# Altium schematic sheet Electromagnet.SchDoc
size A
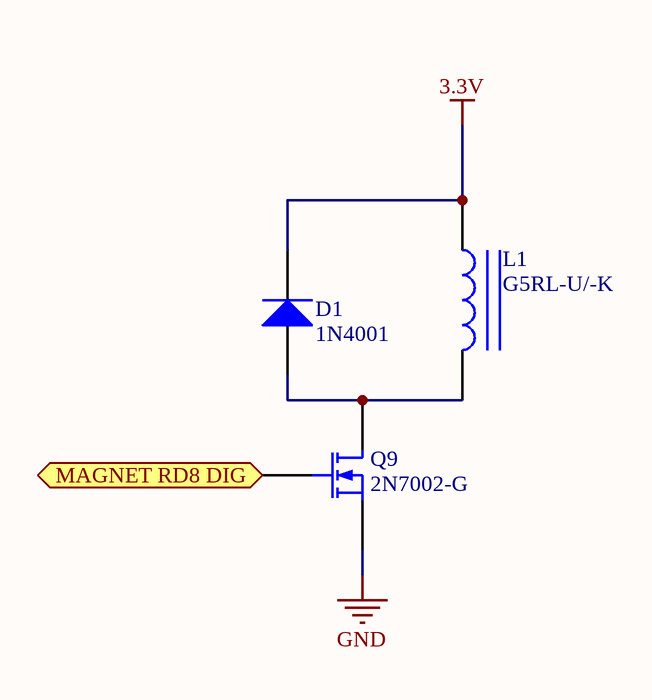
[diagram p0: Electromagnet.SchDoc]

## Parts
D1  1N4001  [Diode]
L1  G5RL-U/-K  [Electromagnet]
Q9  2N7002-G  [Mosfet]

## Ports
MAGNET RD8 DIG

## Nets
3.3V: D1.2(K) L1.1
GND: Q9.2(S)
MAGNET RD8 DIG: Q9.1(G) ; port MAGNET RD8 DIG
NetD1_1: D1.1(A) L1.2 Q9.3(D)

## Library data of the parts
D1 = Diode: Default Diode; Published: 8-Jun-2000; LatestRevisionDate: 17-Jul-2002; LatestRevisionNote: Re-released for DXP Platform.; PackageVersion: Sep-1996; PackageReference: SMC; Publisher: Altium Limited; PackageDescription: DO-214-AB/SMC; 2 C-Bend Leads; Body 7.9 x 5.9 mm, inc. leads (LxW); Code_JEDEC: DO-214-AB; Farnell Reference: 9564993
L1 = Inductor Iron: Magnetic-Core Inductor; Value: 10mH; Published: 24-Mar-1999; LatestRevisionDate: 17-Jul-2002; LatestRevisionNote: Re-released for DXP Platform.; PackageReference: AXIAL-0.9; Publisher: Altium Limited; PackageDescription: Axial Device, Thru-Hole; 2 Leads; 0.9 in Pin Spacing; Farnell Reference: 2432865
Q9 = MOSFET-N: N-Channel MOSFET; Published: 8-Jun-2000; LatestRevisionDate: 17-Jul-2002; LatestRevisionNote: Re-released for DXP Platform.; PackageVersion: 1995/1996; PackageReference: E3; Publisher: Altium Limited; PackageDescription: TO, Flat Index; 3 In-Line, Axial Leads; Body Dia. 4.6mm; Lead Dia. 0.5 mm (max); Farnell Reference: 2775064